# Altium schematic sheet clock_control_touchpad.SchDoc
size A4
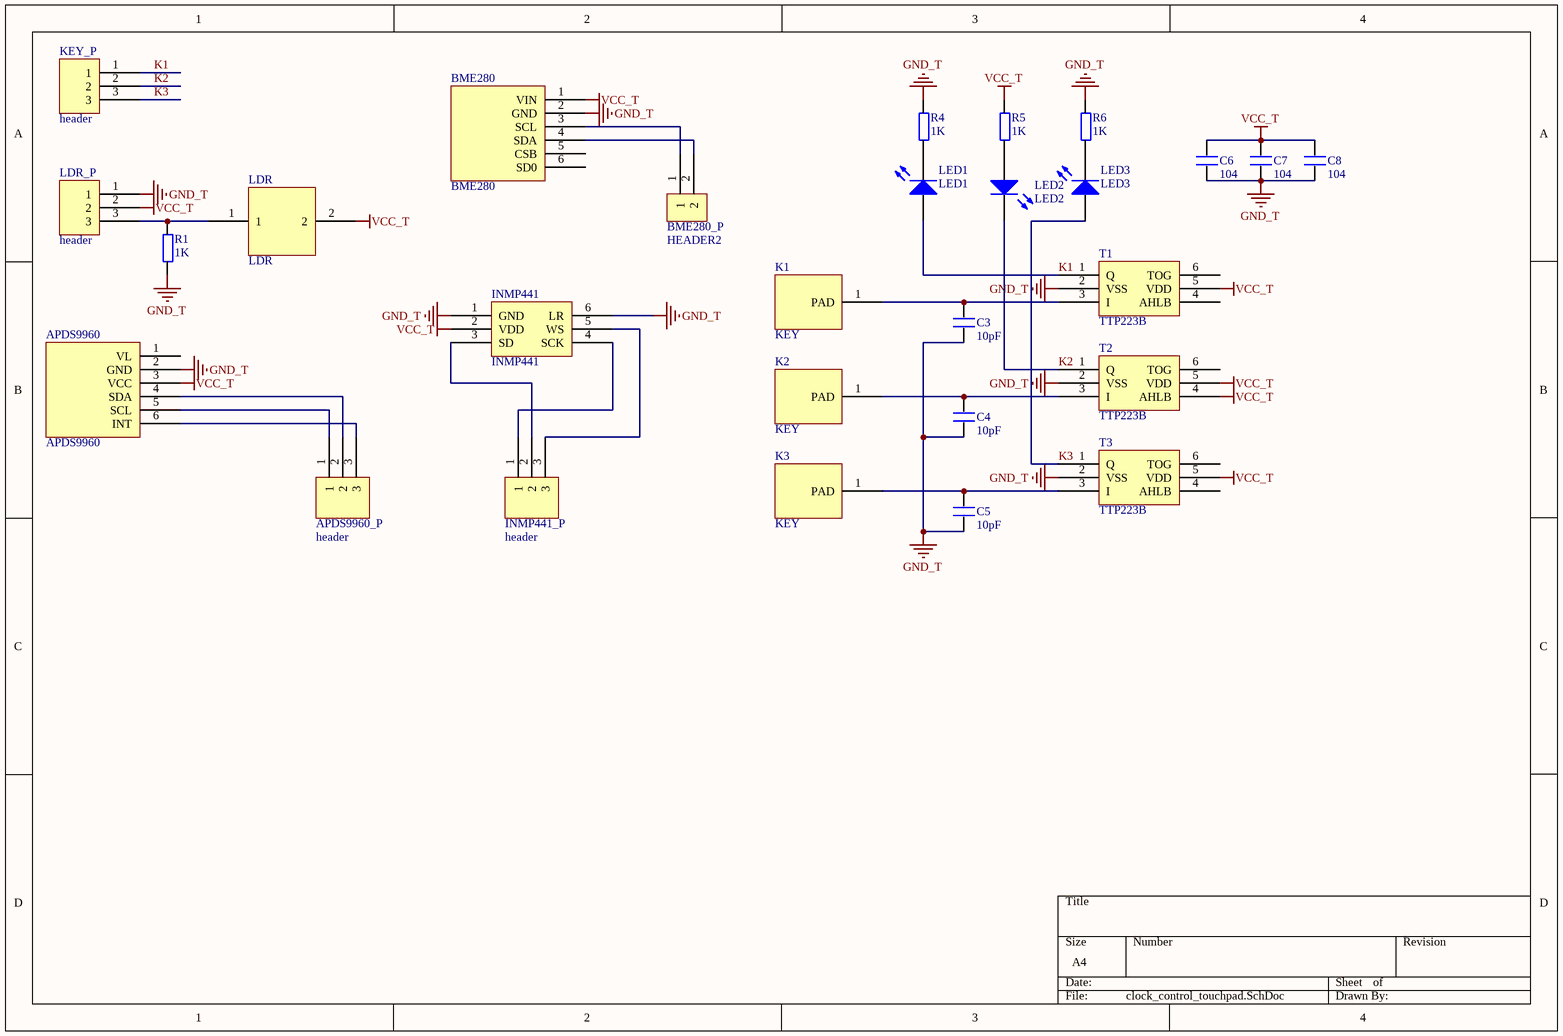
[diagram p0: clock_control_touchpad.SchDoc]

## Parts
APDS9960  APDS9960  [APDS-9960]
APDS9960_P  header  [HEADER3-2.0]
BME280  BME280  [BME280]
BME280_P  HEADER2  [HEADER2-2.0]
C3  10pF  [0603P]
C4  10pF  [0603P]
C5  10pF  [0603P]
C6  104  [0603P]
C7  104  [0603P]
C8  104  [0603P]
INMP441  INMP441  [INMP441]
INMP441_P  header  [HEADER3-2.0]
K1  KEY  [TOUCH-PAD]
K2  KEY  [TOUCH-PAD]
K3  KEY  [TOUCH-PAD]
KEY_P  header  [HEADER3-2.0]
LDR  LDR  [LDR]
LDR_P  header  [HEADER3-2.0]
LED1  LED1  [LED]
LED2  LED2  [LED]
LED3  LED3  [LED]
R1  1K  [0603P]
R4  1K  [0603P]
R5  1K  [0603P]
R6  1K  [0603P]
T1  TTP223B  [TTP223B]
T2  TTP223B  [TTP223B]
T3  TTP223B  [TTP223B]

## Nets
GND_T: APDS9960.2(GND) BME280.2(GND) C3.1 C4.1 C5.1 C6.1 C7.1 C8.1 INMP441.1(GND) INMP441.6(LR) LDR_P.1 R1.1 R4.2 R6.2 T1.2(VSS) T2.2(VSS) T3.2(VSS)
VCC_T: APDS9960.3(VCC) BME280.1(VIN) C6.2 C7.2 C8.2 INMP441.2(VDD) LDR.2 LDR_P.2 R5.2 T1.5(VDD) T2.4(AHLB) T2.5(VDD) T3.5(VDD)
K1: KEY_P.1 LED1.1(A) T1.1(Q)
K2: KEY_P.2 LED2.2(K) T2.1(Q)
K3: KEY_P.3 LED3.1(A) T3.1(Q)
NetAPDS9960_4: APDS9960.4(SDA) APDS9960_P.2
NetAPDS9960_5: APDS9960.5(SCL) APDS9960_P.1
NetAPDS9960_6: APDS9960.6(INT) APDS9960_P.3
NetBME280_3: BME280.3(SCL) BME280_P.1
NetBME280_4: BME280.4(SDA) BME280_P.2
NetC3_2: C3.2 K1.1(PAD) T1.3(I)
NetC4_2: C4.2 K2.1(PAD) T2.3(I)
NetC5_2: C5.2 K3.1(PAD) T3.3(I)
NetINMP441_3: INMP441.3(SD) INMP441_P.2
NetINMP441_4: INMP441.4(SCK) INMP441_P.1
NetINMP441_5: INMP441.5(WS) INMP441_P.3
NetLDR_1: LDR.1 LDR_P.3 R1.2
NetLED1_2: LED1.2(K) R4.1
NetLED2_1: LED2.1(A) R5.1
NetLED3_2: LED3.2(K) R6.1

Not connected (* = marked no-connect by the designer): APDS9960 1(VL); BME280 5(CSB) 6(SD0); T1 4(AHLB) 6(TOG); T2 6(TOG); T3 4(AHLB) 6(TOG)

## Library data of the parts
APDS9960_P INMP441_P KEY_P LDR_P = HEADER3
C3-C8 = C
K1-K3 = TOUCH-PAD
LED1-LED3 = LED2: Typical RED, GREEN, YELLOW, AMBER GaAs LED; Published: 8-Jun-2000; LatestRevisionDate: 17-Jul-2002; LatestRevisionNote: Re-released for DXP Platform.; PackageVersion: Feb-2002; PackageReference: 3.2X1.6X1.1; Publisher: Altium Limited; PackageDescription: SM LED; 2 Flat Leads
R1 R4-R6 = R